# Altium schematic sheet blm_ctrl_power.SchDoc
size A4; DrawnBy: mcattin; Organization: E-ROBOT; DocumentNumber: 1; SheetNumber: 1; SheetTotal: 2
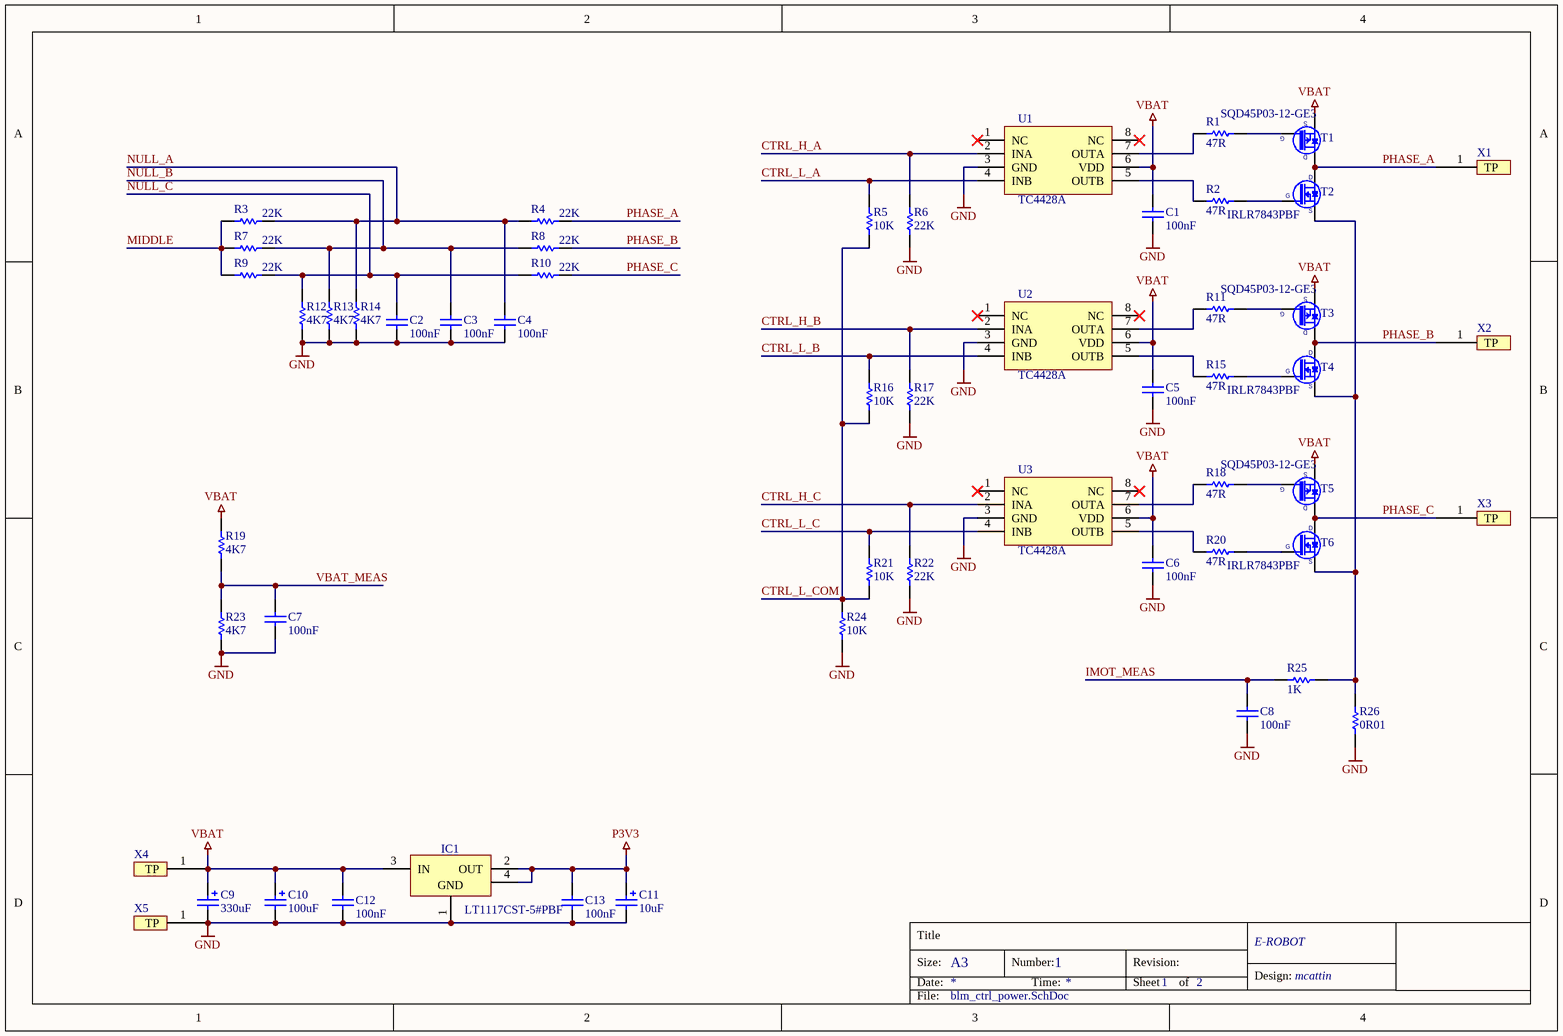
[diagram p0: blm_ctrl_power.SchDoc]

## Parts
C1  value 100nF  [0603]  (hidden comment: Cap)
C2  value 100nF  [0603]  (hidden comment: Cap)
C3  value 100nF  [0603]  (hidden comment: Cap)
C4  value 100nF  [0603]  (hidden comment: Cap)
C5  value 100nF  [0603]  (hidden comment: Cap)
C6  value 100nF  [0603]  (hidden comment: Cap)
C7  value 100nF  [0603]  (hidden comment: Cap)
C8  value 100nF  [0603]  (hidden comment: Cap)
C9  value 330uF  [C00101]  (hidden comment: Cap Pol2)
C10  value 100uF  [C00101]  (hidden comment: Cap Pol2)
C11  value 10uF  [1206]  (hidden comment: Cap Pol2)
C12  value 100nF  [0603]  (hidden comment: Cap)
C13  value 100nF  [0603]  (hidden comment: Cap)
IC1  LT1117CST-5#PBF  [SOT230P700X180-4N]
R1  value 47R  [0603]  (hidden comment: Res1)
R2  value 47R  [0603]  (hidden comment: Res1)
R3  value 22K  [0603]  (hidden comment: Res1)
R4  value 22K  [0603]  (hidden comment: Res1)
R5  value 10K  [0603]  (hidden comment: Res1)
R6  value 22K  [0603]  (hidden comment: Res1)
R7  value 22K  [0603]  (hidden comment: Res1)
R8  value 22K  [0603]  (hidden comment: Res1)
R9  value 22K  [0603]  (hidden comment: Res1)
R10  value 22K  [0603]  (hidden comment: Res1)
R11  value 47R  [0603]  (hidden comment: Res1)
R12  value 4K7  [0603]  (hidden comment: Res1)
R13  value 4K7  [0603]  (hidden comment: Res1)
R14  value 4K7  [0603]  (hidden comment: Res1)
R15  value 47R  [0603]  (hidden comment: Res1)
R16  value 10K  [0603]  (hidden comment: Res1)
R17  value 22K  [0603]  (hidden comment: Res1)
R18  value 47R  [0603]  (hidden comment: Res1)
R19  value 4K7  [0603]  (hidden comment: Res1)
R20  value 47R  [0603]  (hidden comment: Res1)
R21  value 10K  [0603]  (hidden comment: Res1)
R22  value 22K  [0603]  (hidden comment: Res1)
R23  value 4K7  [0603]  (hidden comment: Res1)
R24  value 10K  [0603]  (hidden comment: Res1)
R25  value 1K  [0603]  (hidden comment: Res1)
R26  value 0R01  [2512]  (hidden comment: Res1)
T1  SQD45P03-12-GE3  [TO-252AA]
T2  IRLR7843PBF  [TO-252AA]
T3  SQD45P03-12-GE3  [TO-252AA]
T4  IRLR7843PBF  [TO-252AA]
T5  SQD45P03-12-GE3  [TO-252AA]
T6  IRLR7843PBF  [TO-252AA]
U1  TC4428A  [SOIC127P600-8BN]
U2  TC4428A  [SOIC127P600-8BN]
U3  TC4428A  [SOIC127P600-8BN]
X1  (no value)  [PAD_SMD_2x7MM]
X2  (no value)  [PAD_SMD_2x7MM]
X3  (no value)  [PAD_SMD_2x7MM]
X4  (no value)  [PAD_SMD_2x7MM]
X5  (no value)  [PAD_SMD_2x7MM]

## Nets
GND: C1.2 C2.2 C3.2 C4.2 C5.2 C6.2 C7.2 C8.2 C9.2 C10.2 C11.2 C12.2 C13.2 IC1.1(GND) R6.2 R12.2 R13.2 R14.2 R17.2 R22.2 R23.2 R24.2 R26.2 U1.3(GND) U2.3(GND) U3.3(GND) X5.1(TP)
P3V3: C11.1 C13.1 IC1.2(OUT) IC1.4(OUT)
VBAT: C1.1 C5.1 C6.1 C9.1 C10.1 C12.1 IC1.3(IN) R19.1 T1.3(S) T3.3(S) T5.3(S) U1.6(VDD) U2.6(VDD) U3.6(VDD) X4.1(TP)
CTRL_H_A: R6.1 U1.2(INA)
CTRL_H_B: R17.1 U2.2(INA)
CTRL_H_C: R22.1 U3.2(INA)
CTRL_L_A: R5.1 U1.4(INB)
CTRL_L_B: R16.1 U2.4(INB)
CTRL_L_C: R21.1 U3.4(INB)
CTRL_L_COM: R5.2 R16.2 R21.2 R24.1
IMOT_MEAS: C8.1 R25.2
MIDDLE: R3.1 R7.1 R9.1
NULL_A: C4.1 R3.2 R4.1 R14.1
NULL_B: C3.1 R7.2 R8.1 R13.1
NULL_C: C2.1 R9.2 R10.1 R12.1
PHASE_A: R4.2 T1.4(D) T2.4(D) X1.1(TP)
PHASE_B: R8.2 T3.4(D) T4.4(D) X2.1(TP)
PHASE_C: R10.2 T5.4(D) T6.4(D) X3.1(TP)
VBAT_MEAS: C7.1 R19.2 R23.1
NetR1_1: R1.1 T1.1(G)
NetR1_2: R1.2 U1.7(OUTA)
NetR2_1: R2.1 T2.1(G)
NetR2_2: R2.2 U1.5(OUTB)
NetR11_1: R11.1 T3.1(G)
NetR11_2: R11.2 U2.7(OUTA)
NetR15_1: R15.1 T4.1(G)
NetR15_2: R15.2 U2.5(OUTB)
NetR18_1: R18.1 T5.1(G)
NetR18_2: R18.2 U3.7(OUTA)
NetR20_1: R20.1 T6.1(G)
NetR20_2: R20.2 U3.5(OUTB)
NetR25_1: R25.1 R26.1 T2.3(S) T4.3(S) T6.3(S)

Not connected (* = marked no-connect by the designer): U1 1(NC)* 8(NC)*; U2 1(NC)* 8(NC)*; U3 1(NC)* 8(NC)*

## Notes on the sheet
- Title
- Size:
- Date:
- A3
- Number:
- Time:
- Revision:
- Sheet
- of
- Design:
- File:

## Library data of the parts
C1-C8 C12 C13 = Cap: Capacitor
  C2-C8 C12 C13: Case: 0603
C9-C11 = Cap Pol2: Polarized Capacitor (Axial)
  C9: Case: 0603
  C11: Case: 1206
IC1 = LT1117IST-5#PBF: 3-Terminal Regulator 1=GND 2=OUT 3=IN 4=OUT; Part Description: 5V, 800mA Low-Dropout Positive Regulator; Manufacturer: LINEAR TECHNOLOGY; Fournisseur: Farnell; Ref_fournisseur: 1663357; Part Number: LT1117CST-5#PBF; Device: LT1117CST-5#PBF; Case: SOT223; Price: 5.50 CHF
R1-R26 = Res1: Resistor; Case: 0603
T1 T3 T5 = BSH203: P-CHANNEL MOSFET WITH DIODE; Part Description: P-Channel 30 V (D-S) 175 °C MOSFET; Manufacturer: Vishay; Fournisseur: Farnell; Ref_fournisseur: 1869912; Part Number: SQD45P03-12-GE3; Device: SQD45P03-12-GE3; Footprint: SOT95P230X110-3N; Case: SOT252; Price: 3.60 CHF
T2 T4 T6 = BSS123: N-CHANNEL MOSFET WITH DIODE; Part Description: N MOSFET; Manufacturer: INTERNATIONAL RECTIFIER; Fournisseur: Farnell; Ref_fournisseur: 1013422; Part Number: IRLR7843PBF; Device: IRLR7843PBF; Footprint: SOT-252; Case: SOT252; Price: 2.10 CHF
U1-U3 = TC4428A: Manufacturer: MICROCHIP; Part Description: 1.5A Dual High-Speed Power MOSFET Drivers; Device: TC4428ACOA; Fournisseur: Farnell; Ref_fournisseur: 1332312; Case: SOIC8; Part Number: TC4428ACOA; Price: 1.35 CHF
X1-X5 = TEST_POINT